# Altium project RRC3_COMM_breakout.PrjPcb
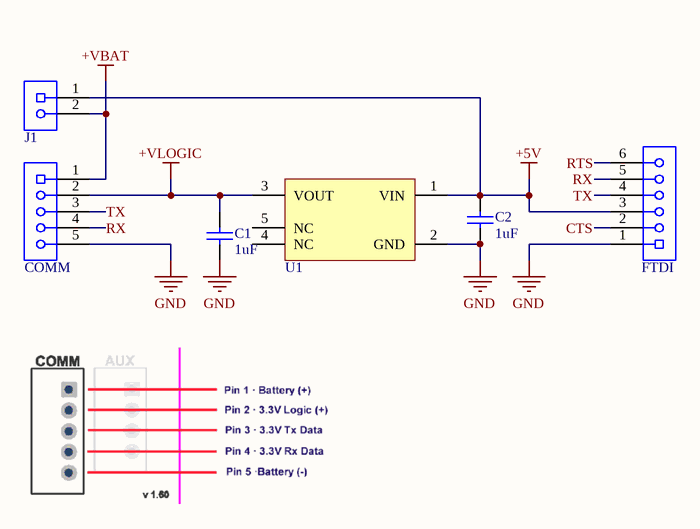
[diagram p0: Sheet1.SchDoc]
1 sheet, 6 parts. Net scope: global (net labels, ports and power ports of the same name join across sheets).
Board file: PCB2.PcbDoc

## Sheet Sheet1.SchDoc
size A4; Organization: Altium Limited; Address1: L3, 12a Rodborough Rd; Address2: Frenchs Forest; Address3: NSW; Address4: Australia 2086; SheetNumber: 1; SheetTotal: 1

### Parts
C1  value 1uF  [CAPC1608X10N]  (hidden comment: C0603C105K8PACTU)
C2  value 1uF  [CAPC1608X10N]  (hidden comment: C0603C105K8PACTU)
COMM  DF3-5S-2DSA(25)  [DF3-5S-2DSA(25)-Footprint-1]  (value not drawn)
FTDI  68000-406HLF  [68000-406HLF-Footprint-1]  (value not drawn)  (no BOM)
J1  22-28-4020  [22-28-4020-Footprint-1]  (value not drawn)  (no BOM)
U1  AP7370-33WW-7  [SOT95P285X140-5N]  (value not drawn)

### Nets
+5V: C2.2 FTDI.3 J1.1 U1.1(VIN)
+VBAT: COMM.1 J1.2
+VLOGIC: C1.2 COMM.2 U1.3(VOUT)
GND: C1.1 C2.1 COMM.5 FTDI.1 U1.2(GND)
CTS: FTDI.2
RTS: FTDI.6
RX: COMM.4 FTDI.5
TX: COMM.3 FTDI.4

Not connected (* = marked no-connect by the designer): U1 4(NC) 5(NC)

### Notes on the sheet
- Title:
- Designer:
- Date:
- Size:
- Revision:
- A4
- Sheet:
- !
- UWA Aerospace, 35 Stirling Hwy, Perth WA 6009, Australia

### Library data of the parts
C1 C2 = CMP-00045-1: Cap Ceramic 1uF 10V X5R 10% SMD 0603 85°C Paper T/R; Capacitance: 1uF; Voltage Rating (DC): 10V; Case/Package: 0603; Height: 0.8mm; Tolerance: 10%; Width: 0.031inch; Lead Free: Lead Free; Mount: Surface Mount; Length: 1.6mm; Number of Pins: 2; Radiation Hardening: No; Dielectric: X5R; Voltage: 10V; Depth: 0.8mm; Weight: 7.1E-05oz; REACH SVHC: No SVHC; Package Quantity: 1; Max Operating Temperature: 85°C; Case Code (Imperial): 0603; Thickness: 0.035inch; Min Operating Temperature: -55°C; Dielectric Material: Ceramic; Case Code (Metric): 1608; Packaging: Tape and Reel; Voltage Rating: 10V; Termination: SMD/SMT
COMM = CMP-00604-1: Board-to-Cable Connector (Terminal 1 Row Type) with 2-mm Pitch - DF3 Series (HIROSE ELECTRIC); Voltage Rating: 250V; Number of Positions: 5; Pitch: 2mm; Connector Type: Receptacle; Current Rating: 3A; Termination: Solder; Number of Rows: 1; Radiation Hardening: No; Mounting Technology: Through Hole; Contact Plating: Tin; Fastening Type: Ramp; Contact Gender: Female; Contact Type: Female Socket; Series: DF3; Color: Black; Package Quantity: 40; Number of Contacts: 5; Packaging: Rail/Tube; Contact Material: Bronze
FTDI = CMP-00021-3: CONN HEADER 6POS .100 STR TIN; Max Voltage Rating (AC): 1.5kV; Contact Post Length: 2.41mm; Gender: Male; Insulation Resistance: 5GR; Pitch: 2.54mm; Connector Type: Male Pin; Current Rating: 3A; Number of Contacts: 6; Depth: 2.41mm; Package Quantity: 100; Packaging: Bulk; Orientation: Straight; REACH SVHC: No SVHC; Contact Gender: Male; Max Operating Temperature: 125°C; Number of Rows: 1; Length: 15.24mm; Termination: Solder; Radiation Hardening: No; Flammability Rating: UL94 V-0; Color: Black; Min Operating Temperature: -65°C; Contact Mating Length: 0.23inch; Voltage Rating: 1.5kV; Housing Material: Thermoplastic; Contact Material: Bronze; Contact Plating: Tin; Mount: Through Hole; Housing Color: Black; Number of Positions: 6
J1 = CMP-00157-4: KK 254 Breakaway Header, Vertical, 2 Circuits, Tin (Sn) Plating, Mating Pin Length 6.09mm 2 POS; Number of Positions: 2; Connector Type: Male Pin; Max Voltage Rating (AC): 250V; Current Rating: 4A; Pitch: 2.54mm; Contact Resistance: 20mR; Gender: Male; Glow Wire Compliant: Non-compliant; Mounting Technology: Through Hole; Color: Black; Contact Mating Length: 0.24inch; Depth: 2.49mm; Termination: Solder; Max Operating Temperature: 75°C; Package Quantity: 1; Number of Rows: 1; Flammability Rating: UL94 V-0; Contact Plating: Tin; Contact Material: Brass,Bronze; Voltage Rating (DC): 250V; Max Voltage Rating (DC): 250V; Mount: Through Hole; Min Operating Temperature: 0°C; Housing Color: Black; Series: KK® 42375; Housing Material: Nylon; Radiation Hardening: No; Number of Circuits: 2; Voltage Rating: 250V; Packaging: Bulk; Number of Contacts: 2; Contact Type: Male Pin; REACH SVHC: Unknown; Lead Free: Lead Free; Orientation: Straight
U1 = CMP-00571-1: LDO Regulator Pos 3.3V 0.3A 5-Pin SOT-25 T/R; Number of Regulators: 1; Output Type: Fixed; Quiescent Current: 2.5uA; Output Current: 300mA; Max Supply Voltage: 18V; Max Supply Current: 300uA; Output Configuration: Positive; Mounting Technology: Surface Mount; Case/Package: SOT-25; Series: -; Min Output Voltage: 3.3V; Min Operating Temperature: -40°C; Max Operating Temperature: 125°C